# EAGLE schematic SolarPwrOption_short (EAGLE 7.6.0)
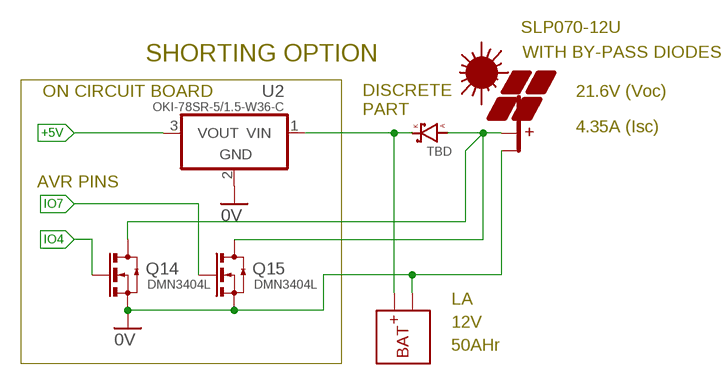
[diagram p0: schematic, sheet 1]

## Parts
_D1  TBD  DSMB  [SMB]
PV1  PV  [NA-30]
Q14  DMN3404L  N-CHDPAK  [DPAK]
Q15  DMN3404L  N-CHDPAK  [DPAK]
U2  OKI-78SR-5/1.5-W36-C  OKI-78SR-H  [OKI-78SR-H]
U$10  BAT  [NA-30]

## Nets
0V: PV1.2(-PV) Q14.3(S) Q15.3(S) U2.2(GND) U$10.2(-BAT)
+5V: U2.3(VOUT)
IO4: Q14.1(G)
IO7: Q15.1(G)
N$4: _D1.K U2.1(VIN) U$10.1(+BAT)
N$8: _D1.A PV1.1(+PV) Q14.SINK(D) Q15.SINK(D)

## Notes on the sheet
- SLP070-12U
- SHORTING OPTION | WITH BY-PASS DIODES
- ON CIRCUIT BOARD | 21.6V (Voc)
- DISCRETE 
  PART
- 4.35A (Isc)
- AVR PINS
- LA
- 12V
- 50AHr

## Library data of the parts
_D1 = D-SBR:D: DIODE
PV1 = Documentation:PV
Q14 Q15 = Q-NCH:N-CH?*: ENHANCEMENT MODE MOSFET SOT23 is BSS138 pinout
U2 = P-DCDC:OKI-78SR: OKI-78SR OKI-78SR-5/1.5-W36H-C 5V@1.5A Horizontal Mount OKI-78SR-5/1.5-W36-C 5V@1.5A Vert Mount OKI-78SR-3.3/1.5-W36H-C 3.3V@1.5A Horizontal Mount OKI-78SR-3.3/1.5-W36-C 3.3V@1.5A Vert Mount Murata Power Solutions 7 to 36 VDC input range need to verify pinout
U$10 = Documentation:BAT